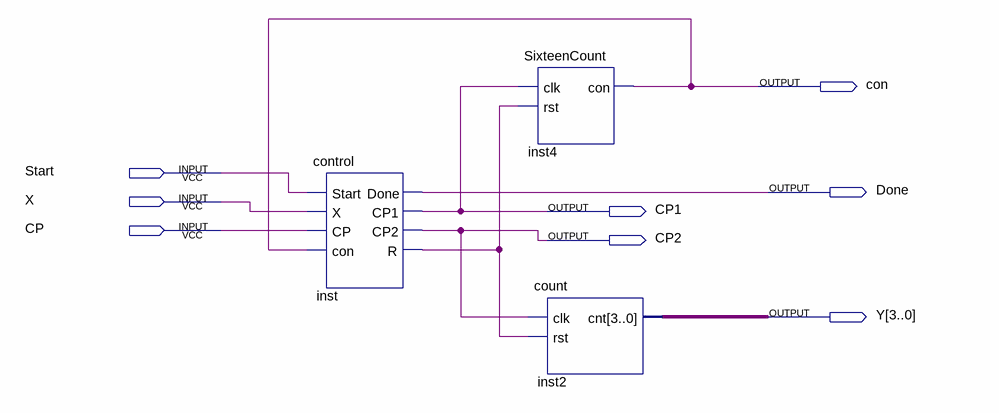
[diagram p0: schematic sheet]
// Quartus schematic demo.bdf as structural Verilog: 3 symbols, 8 pins
module demo (
  input  Start,
  input  X,
  input  CP,
  output con,
  output Done,
  output CP1,
  output CP2,
  output [3:0] Y
);

  wire inst_r;

  control inst (.Start(Start), .X(X), .CP(CP), .con(con), .Done(Done), .CP1(CP1), .CP2(CP2), .R(inst_r));
  SixteenCount inst4 (.clk(CP1), .rst(inst_r), .con(con));
  count inst2 (.clk(CP2), .rst(inst_r), .cnt(Y));
endmodule
